# EAGLE design ModPad_1.0 (EAGLE 9.7.0)
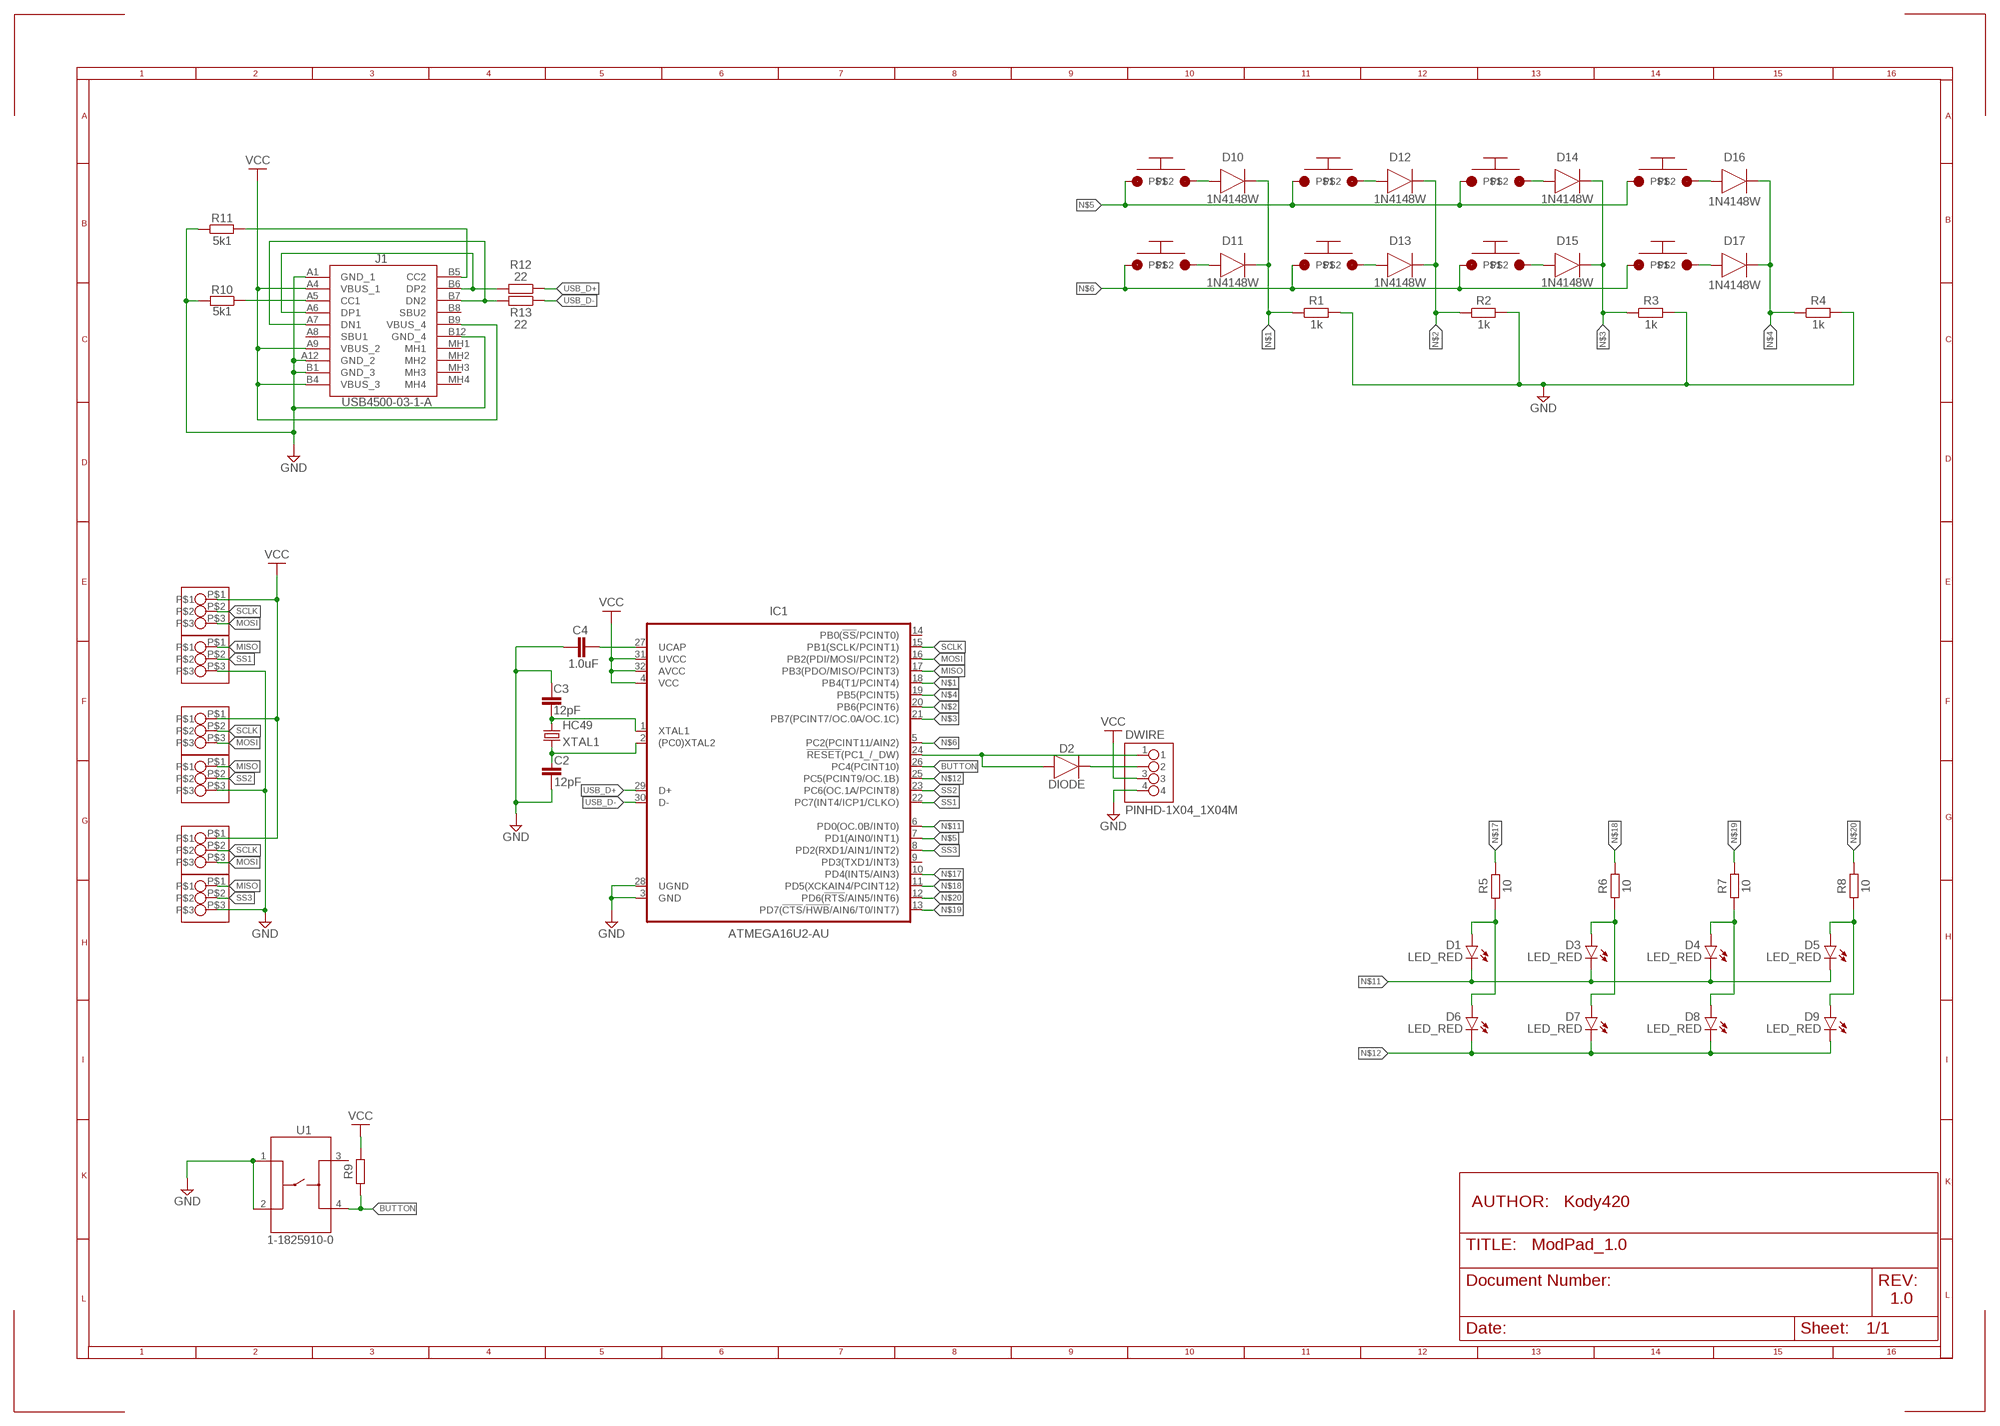
[diagram p0: schematic, sheet 1]

## Parts
C2  12pF  12PF-0603-50V-5%  [0603]
C3  12pF  12PF-0603-50V-5%  [0603]
C4  1.0uF  1.0UF-0603-16V-10%  [0603]
D1  LED_RED  CHIP-FLAT-R_0603-0.80MM  [LEDC1608X80N_FLAT-R]
D2  DIODE  DIODE_DO-219-AC(SOD323F)  [SODFL2513X70]
D3  LED_RED  CHIP-FLAT-R_0603-0.80MM  [LEDC1608X80N_FLAT-R]
D4  LED_RED  CHIP-FLAT-R_0603-0.80MM  [LEDC1608X80N_FLAT-R]
D5  LED_RED  CHIP-FLAT-R_0603-0.80MM  [LEDC1608X80N_FLAT-R]
D6  LED_RED  CHIP-FLAT-R_0603-0.80MM  [LEDC1608X80N_FLAT-R]
D7  LED_RED  CHIP-FLAT-R_0603-0.80MM  [LEDC1608X80N_FLAT-R]
D8  LED_RED  CHIP-FLAT-R_0603-0.80MM  [LEDC1608X80N_FLAT-R]
D9  LED_RED  CHIP-FLAT-R_0603-0.80MM  [LEDC1608X80N_FLAT-R]
D10  1N4148W  DIODE_1N4148W-7-F_SOD123G  [SOD3715X135]
D11  1N4148W  DIODE_1N4148W-7-F_SOD123G  [SOD3715X135]
D12  1N4148W  DIODE_1N4148W-7-F_SOD123G  [SOD3715X135]
D13  1N4148W  DIODE_1N4148W-7-F_SOD123G  [SOD3715X135]
D14  1N4148W  DIODE_1N4148W-7-F_SOD123G  [SOD3715X135]
D15  1N4148W  DIODE_1N4148W-7-F_SOD123G  [SOD3715X135]
D16  1N4148W  DIODE_1N4148W-7-F_SOD123G  [SOD3715X135]
D17  1N4148W  DIODE_1N4148W-7-F_SOD123G  [SOD3715X135]
DWIRE  PINHD-1X04_1X04M  [1X04]
IC1  ATMEGA16U2-AU  [QFP80P900X900X120-32]
J1  USB4500-03-1-A  [USB4500031A]
R1  1k  R_CHIP-0402(1005-METRIC)  [RESC1005X40]
R2  1k  R_CHIP-0402(1005-METRIC)  [RESC1005X40]
R3  1k  R_CHIP-0402(1005-METRIC)  [RESC1005X40]
R4  1k  R_CHIP-0402(1005-METRIC)  [RESC1005X40]
R5  10  R_CHIP-0402(1005-METRIC)  [RESC1005X40]
R6  10  R_CHIP-0402(1005-METRIC)  [RESC1005X40]
R7  10  R_CHIP-0402(1005-METRIC)  [RESC1005X40]
R8  10  R_CHIP-0402(1005-METRIC)  [RESC1005X40]
R9  R_CHIP-0402(1005-METRIC)  [RESC1005X40]
R10  5k1  R_CHIP-0402(1005-METRIC)  [RESC1005X40]
R11  5k1  R_CHIP-0402(1005-METRIC)  [RESC1005X40]
R12  22  R_CHIP-0402(1005-METRIC)  [RESC1005X40]
R13  22  R_CHIP-0402(1005-METRIC)  [RESC1005X40]
U1  1-1825910-0  [SWITCH_1-1825910-0]
U$1  SMD-POGO-3XSMD-POGO-FEMALE-3X  [POGO-FEMALE-3X]
U$2  AKKO-SWITCH  [AKKO-SWITCH]
U$3  AKKO-SWITCH  [AKKO-SWITCH]
U$4  AKKO-SWITCH  [AKKO-SWITCH]
U$5  AKKO-SWITCH  [AKKO-SWITCH]
U$6  AKKO-SWITCH  [AKKO-SWITCH]
U$7  AKKO-SWITCH  [AKKO-SWITCH]
U$8  AKKO-SWITCH  [AKKO-SWITCH]
U$9  AKKO-SWITCH  [AKKO-SWITCH]
U$10  SMD-POGO-3XSMD-POGO-FEMALE-3X  [POGO-FEMALE-3X]
U$11  SMD-POGO-3XSMD-POGO-FEMALE-3X  [POGO-FEMALE-3X]
U$12  SMD-POGO-3XSMD-POGO-FEMALE-3X  [POGO-FEMALE-3X]
U$13  SMD-POGO-3XSMD-POGO-FEMALE-3X  [POGO-FEMALE-3X]
U$14  SMD-POGO-3XSMD-POGO-FEMALE-3X  [POGO-FEMALE-3X]
XTAL1  HC49  CRYSTAL_HC49-11.5L  [XTALRR488W45L1150T500H350B]

## Nets
BUTTON: IC1.26(PC4(PCINT10)) R9.1 U1.4
DN: J1.A7(DN1) J1.B7(DN2) R13.2
DP: J1.A6(DP1) J1.B6(DP2) R12.2
GND: C2.2 C3.2 C4.1 DWIRE.4 IC1.3(GND) IC1.28(UGND) J1.A1(GND_1) J1.A12(GND_2) J1.B1(GND_3) J1.B12(GND_4) R1.2 R2.2 R3.2 R4.2 R10.2 R11.1 U1.1 U1.2 U$10.P$3 U$13.P$3 U$14.P$3
MISO: IC1.17(PB3(PDO/MISO/PCINT3)) U$10.P$1 U$13.P$1 U$14.P$1
MOSI: IC1.16(PB2(PDI/MOSI/PCINT2)) U$1.P$3 U$11.P$3 U$12.P$3
N$1: D10.1(C) D11.1(C) IC1.18(PB4(T1/PCINT4)) R1.1
N$2: D12.1(C) D13.1(C) IC1.20(PB6(PCINT6)) R2.1
N$3: D14.1(C) D15.1(C) IC1.21(PB7(PCINT7/OC.0A/OC.1C)) R3.1
N$4: D16.1(C) D17.1(C) IC1.19(PB5(PCINT5)) R4.1
N$5: IC1.7(PD1(AIN0/INT1)) U$2.P$1 U$3.P$1 U$4.P$1 U$5.P$1
N$6: IC1.5(PC2(PCINT11/AIN2)) U$6.P$1 U$7.P$1 U$8.P$1 U$9.P$1
N$7: C4.2 IC1.27(UCAP)
N$8: D2.1(C) DWIRE.2
N$9: C3.1 IC1.1(XTAL1) XTAL1.1
N$10: C2.1 IC1.2((PC0)XTAL2) XTAL1.2
N$11: D1.C D3.C D4.C D5.C IC1.6(PD0(OC.0B/INT0))
N$12: D6.C D7.C D8.C D9.C IC1.25(PC5(PCINT9/OC.1B))
N$13: D1.A D6.A R5.2
N$14: D3.A D7.A R6.1
N$15: D4.A D8.A R7.1
N$16: D5.A D9.A R8.1
N$17: IC1.10(PD4(INT5/AIN3)) R5.1
N$18: IC1.11(PD5(XCKAIN4/PCINT12)) R6.2
N$19: IC1.13(PD7(!CTS!/!HWB!/AIN6/T0/INT7)) R7.2
N$20: IC1.12(PD6(!RTS!/AIN5/INT6)) R8.2
N$21: D15.2(A) U$8.P$2
N$22: D14.2(A) U$4.P$2
N$23: D12.2(A) U$3.P$2
N$24: D13.2(A) U$7.P$2
N$25: D10.2(A) U$2.P$2
N$26: D11.2(A) U$6.P$2
N$27: D16.2(A) U$5.P$2
N$28: D17.2(A) U$9.P$2
N$29: J1.B5(CC2) R11.2
N$30: J1.A5(CC1) R10.1
RXD: D2.2(A) DWIRE.1 IC1.24(!RESET!(PC1_/_DW))
SCLK: IC1.15(PB1(SCLK/PCINT1)) U$1.P$2 U$11.P$2 U$12.P$2
SS1: IC1.22(PC7(INT4/ICP1/CLKO)) U$13.P$2
SS2: IC1.23(PC6(OC.1A/PCINT8)) U$10.P$2
SS3: IC1.8(PD2(RXD1/AIN1/INT2)) U$14.P$2
USB_D+: IC1.29(D+) R12.1
USB_D-: IC1.30(D-) R13.1
VCC: DWIRE.3 IC1.4(VCC) IC1.31(UVCC) IC1.32(AVCC) J1.A4(VBUS_1) J1.A9(VBUS_2) J1.B4(VBUS_3) J1.B9(VBUS_4) R9.2 U$1.P$1 U$11.P$1 U$12.P$1
Unconnected: IC1.9(PD3(TXD1/INT3)) IC1.14(PB0(!SS!/PCINT0)) J1.A8(SBU1) J1.B8(SBU2) J1.MH1 J1.MH2 J1.MH3 J1.MH4 U1.3

## Notes on the sheet
- AUTHOR: | Kody420
- 1.0

## Library data of the parts
C2 C3 = SparkFun-Capacitors:12PF: 12pF ceramic capacitors A capacitor is a passive two-terminal electrical component used to store electrical energy temporarily in an electric field.; PROD_ID: CAP-09137
C4 = SparkFun-Capacitors:1.0UF: 1µF ceramic capacitors A capacitor is a passive two-terminal electrical component used to store electrical energy temporarily in an electric field.; PROD_ID: CAP-00868
D1 D3-D9 = LED:CHIP-FLAT-R; CATEGORY: LED; COLOR: RED; DESCRIPTION: CHIP LED FLAT; SUB-CATEGORY: CHIP; TYPE: FLAT_TOP
D2 = Diode:DIODE: Diode Rectifier - Generic; CATEGORY: Diode; SUB-CATEGORY: Rectifier
D10-D17 = Diode:DIODE_: Diode Rectifier - Popular parts; CATEGORY: Diode; DESCRIPTION: DIODE GEN PURP 100V 300MA SOD123; MANUFACTURER: Diodes Incorporated; SUB-CATEGORY: Rectifier
DWIRE = Tinkercad:PINHD-1X04
IC1 = IC_Embedded:ATMEGA*U2: 8-bit Microcontroller Datasheet <https://ww1.microchip.com/downloads/en/DeviceDoc/doc7799.pdf> Note:For this part User needs to add thermal via in thermal pad in QFN package while designing a board.; CATEGORY: IC_Embedded; CORE: AVR; DESCRIPTION: IC MCU 8BIT 16KB FLASH 32TQFP; MANUFACTURER: Microchip Technology; MPN: ATMEGA16U2-AU; OPERATING_TEMP: -40°C to +85°C; PART_STATUS: Active; ROHS_COMPLIANT: COMPLIANT; SUB-CATEGORY: Microcontroller; TYPE: 8 bit Microcontroller
J1 = USB-C:USB4500-03-1-A: USB Connectors USB C Rec 16P 3u" Mid Mnt 0.8mm O-set SMT L = 6.5mm S-Spring-1 Source: Datasheet; DESCRIPTION: USB Connectors USB C Rec 16P 3u" Mid Mnt 0.8mm O-set SMT L = 6.5mm S-Spring-1; HEIGHT: 3.36mm; MANUFACTURER_NAME: GCT (GLOBAL CONNECTOR TECHNOLOGY); MANUFACTURER_PART_NUMBER: USB4500-03-1-A
R1-R13 = Resistor:R: Resistor Fixed - Generic; CATEGORY: Resistor; SUB-CATEGORY: Fixed
U1 = Switches:1-1825910-0; BUILT_BY: EMA_UL_Team; CATEGORY: Tactile Switches; COPYRIGHT: Copyright (C) 2016 Accelerated Designs. All rights reserved; DESCRIPTION: FSM6JH=6MM TACT SWITCH, HIGH TEMP; MANUFACTURER_PART_NUMBER: 1-1825910-0; PART_STATUS: active; SERIES: Unknown; VENDOR: TE Connectivity
U$1 U$10-U$14 = SMD-POGO-3X:SMD-POGO-3X
U$2-U$9 = Switch:AKKO-SWITCH
XTAL1 = Frequency-Source:CRYSTAL: Crystal 2Pin - Generic; CATEGORY: Frequency-Source; SUB-CATEGORY: Crystal-2Pin

## Board
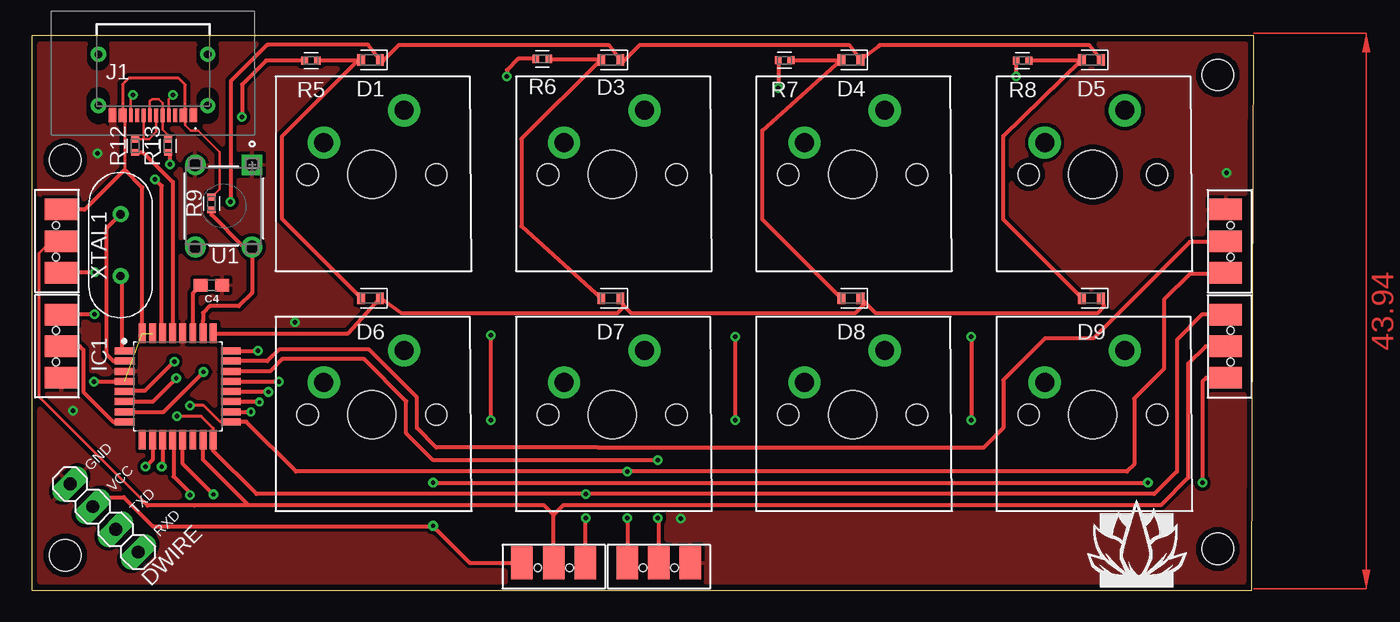
[diagram p1: board, top side]
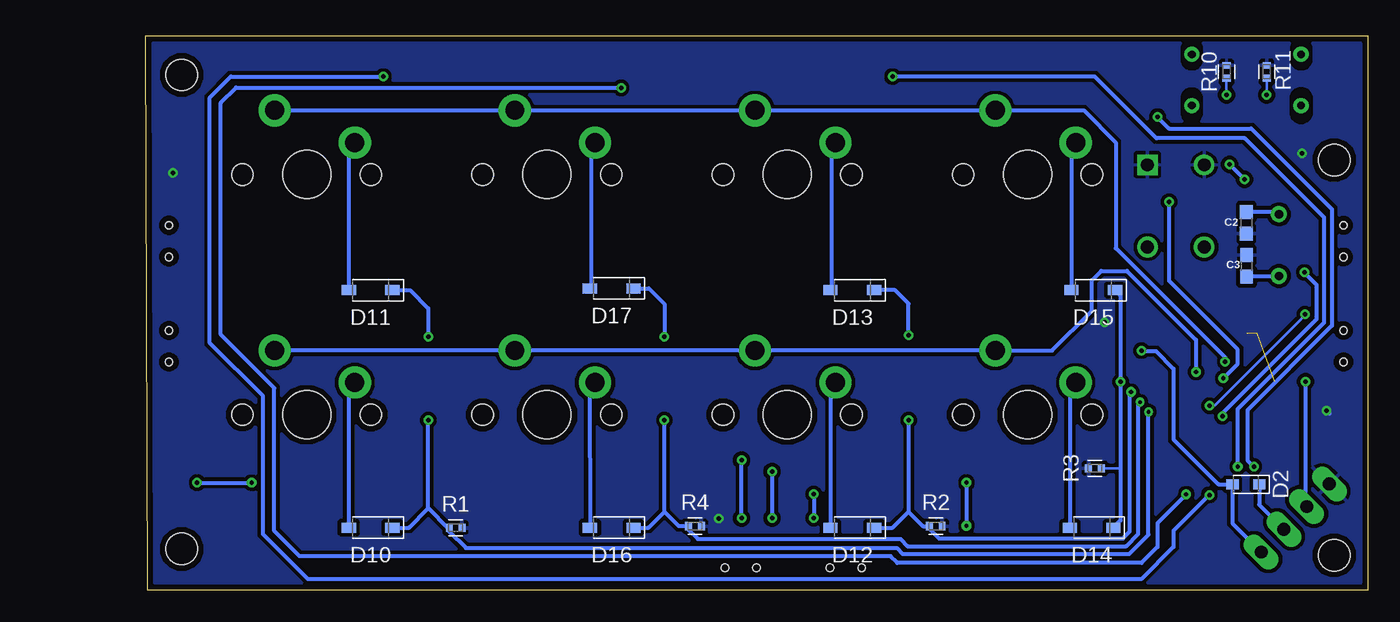
[diagram p2: board, bottom side, seen from below]

Size 96.63 x 43.87 mm. Coordinates in mm from the lower left corner, seen from the top.
Outline: 0,43.87 0,0 96.5,0 96.63,43.87 0,43.87
Copper layers (1*16): Top / Bottom
Stack-up Default Layer Stack: Top User Defined 0.035mm / Dielectric-1 User Defined 1.5mm / Bottom User Defined 0.035mm
Design rules: minimum copper width 8mil, minimum drill size 0.3mm, copper clearance wire_polygon to wire_polygon 12mil, copper clearance wire_polygon to pad_smd 12mil, copper clearance wire_polygon to via 12mil, copper clearance pad_smd to via 12mil, copper clearance via to via 12mil, copper clearance smd to pad (same net) 12mil, copper clearance smd to via (same net) 12mil, copper clearance smd to smd (same net) 12mil, copper clearance pad_smd to pad_smd 6mil, dimension clearance 18mil, via restrict clearance 0mil, restrict clearance 0mil, drill distance 6mil, keepout clearance 0mil
Holes 2.5 mm at 2.66,34.04 93.8,3.27 93.8,40.77 2.66,2.77

### Footprints (pad centres in the part's own frame; a part is rotated, then mirrored left to right if it is on the bottom)
0603 = smd 1.1 x 1: 1 -0.85,0; 2 0.85,0
LEDC1608X80N_FLAT-R = smd 0.612 x 0.912: A 0.75,0; C -0.75,0
SODFL2513X70 = smd 0.985 x 0.774: 1 -1.065,0; 2 1.065,0
SOD3715X135 = smd 1.127 x 0.784: 1 -1.722,0; 2 1.722,0
1X04 = drill 1.016 long: 1 -3.81,0; 2 -1.27,0; 3 1.27,0; 4 3.81,0
QFP80P900X900X120-32 = smd 1.55 x 0.55: 1 -4.2,2.8; 2 -4.2,2; 3 -4.2,1.2; 4 -4.2,0.4; 5 -4.2,-0.4; 6 -4.2,-1.2; 7 -4.2,-2; 8 -4.2,-2.8; 17 4.2,-2.8; 18 4.2,-2; 19 4.2,-1.2; 20 4.2,-0.4; 21 4.2,0.4; 22 4.2,1.2; 23 4.2,2; 24 4.2,2.8 | smd 0.55 x 1.55: 9 -2.8,-4.2; 10 -2,-4.2; 11 -1.2,-4.2; 12 -0.4,-4.2; 13 0.4,-4.2; 14 1.2,-4.2; 15 2,-4.2; 16 2.8,-4.2; 25 2.8,4.2; 26 2,4.2; 27 1.2,4.2; 28 0.4,4.2; 29 -0.4,4.2; 30 -1.2,4.2; 31 -2,4.2; 32 -2.8,4.2
USB4500031A = smd 0.3 x 1.1: A1 -3.35,3.625; A4 -2.55,3.625; A5 -1.25,3.625; A6 -0.25,3.625; A7 0.25,3.625; A8 1.25,3.625; A9 2.55,3.625; A12 3.35,3.625; B1 3.05,3.625; B4 2.25,3.625; B5 1.75,3.625; B6 0.75,3.625; B7 -0.75,3.625; B8 -1.75,3.625; B9 -2.25,3.625; B12 -3.05,3.625 | drill 0.6 pad 1.1 slot 1.7 rotated 90: MH1 -4.32,2.85; MH2 4.32,2.85 | drill 0.6 pad 1.1 slot 1.4 rotated 90: MH3 -4.32,-1.21; MH4 4.32,-1.21
RESC1005X40 = smd 0.535 x 0.644: 1 -0.507,0; 2 0.507,0
SWITCH_1-1825910-0 = drill 1.016 pad 1.524 square: 1 -6.502,4.496 | drill 1.016 pad 1.524: 2 -6.502,0; 3 0,0; 4 0,4.496
POGO-FEMALE-3X = smd 1.7 x 2.6: P$1 2.5,-1.3; P$2 0,-1.3; P$3 -2.5,-1.3 | hole 0.6: -1.25,-0.9; 1.25,-0.9
AKKO-SWITCH = drill 1.499 pad 2.54: P$1 10.16,12.7; P$2 3.81,10.16 | hole 3.81: 7.62,7.62 | hole 1.702: 2.54,7.62; 12.7,7.62
XTALRR488W45L1150T500H350B = drill 0.657 pad 1.257: 1 -2.44,0; 2 2.44,0

### Placement (x,y rotation side)
C2  9.62,29.07 270 bottom
C3  9.58,25.66 90 bottom
C4  14.22,24.13 180 top
D1  26.8,41.96 180 top
D2  9.65,8.38 180 bottom
D3  45.8,41.96 180 top
D4  64.8,41.96 180 top
D5  83.8,41.96 180 top
D6  26.8,23.11 180 top
D7  45.8,23.11 180 top
D8  64.8,23.11 180 top
D9  83.8,23.11 180 top
D10  78.87,4.95 180 bottom
D11  78.87,23.75 180 bottom
D12  40.77,4.95 180 bottom
D13  40.77,23.75 180 bottom
D14  21.84,4.95 180 bottom
D15  21.72,23.75 180 bottom
D16  59.8,4.95 180 bottom
D17  59.8,23.88 180 bottom
DWIRE  5.74,5.72 135 top
IC1  11.56,16.13 0 top
J1  9.6,41.19 180 top
R1  72.14,4.95 0 bottom
R2  34.16,5.08 0 bottom
R3  21.59,9.65 180 bottom
R4  53.21,5.08 0 bottom
R5  22.1,41.91 0 top
R6  40.39,42.04 180 top
R7  59.55,41.92 180 top
R8  78.36,41.91 180 top
R9  14.22,30.61 90 top
R10  11.18,41.02 90 bottom
R11  8,41.02 270 bottom
R12  8.19,35.16 90 top
R13  10.79,35.16 90 top
U1  12.94,27.16 270 top
U$1  95.71,19.3 270 top
U$2  76.3,6.27 0 top
U$3  38.3,6.27 0 top
U$4  19.3,6.27 0 top
U$5  57.3,6.27 0 top
U$6  76.3,25.27 0 top
U$7  38.3,25.27 0 top
U$8  19.3,25.27 0 top
U$9  57.3,25.27 0 top
U$10  95.71,27.63 270 top
U$11  1.03,27.63 90 top
U$12  41.27,0.89 180 top
U$13  49.6,0.89 180 top
U$14  1.03,19.3 90 top
XTAL1  7.03,27.31 90 top

### Tracks (layer width: path | path; a pad name or v marks a point on that pad's centre or on a via)
BUTTON
  Top 0.305: R9.1 14.22,29.72 16.79,27.16 U1.4 17.43,23.53 16.38,22.48 14.1,22.48 13.56,21.94 13.56,21.35 13.56,21.21 IC1.26
DN
  Top 0.203: J1.A7 9.35,38.69 9.52,38.86 10.03,38.86 10.35,38.54 J1.B7 10.35,36.45 10.79,36.01 R13.2
DP
  Top 0.203: R12.2 8.22,35.7 8.85,35.7 | J1.A6 9.85,36.27 9.28,35.7 8.85,35.7 | J1.B6 8.85,35.7
  Top 0.254: J1.B6
GND  (via drill 0.35)
  Bottom 0.305: 3.04,13.99 v3.28,14.22
  other vias: 94.49,33.02 51.33,5.66 20.83,21.21 5.19,34.56
  pour Bottom: 0.13,44.07 0.13,-0.38 96.65,-0.38 96.65,44.07
  pour Top: -2.41,47.88 -2.41,-2.92 99.19,-2.92 99.19,47.88
MISO  (via drill 0.35)
  Top 0.254: v12.52,14.6 12.55,14.63 13.59,14.63 14.9,13.33 IC1.17
  Top 0.305: U$10.P$1 94.3,25.02 91.57,25.02 89.53,22.99 89.53,17.53 87.18,15.17 87.18,9.97 86.61,9.4 v47.12,9.4 20.91,9.4 16.98,13.33 IC1.17 | 2.44,21.7 U$14.P$1 2.37,21.84 4.96,21.84 v4.97,21.83 | v47.12,5.71 47.12,2.21 U$13.P$1
  Bottom 0.254: v12.52,14.6 12.15,14.6 4.96,21.8
  Bottom 0.305: v47.12,9.4 v47.12,5.71 | v4.97,21.83 4.97,21.8 4.96,21.8
MOSI  (via drill 0.35)
  Top 0.254: IC1.16 14.36,12.83 13.41,13.77 v11.5,13.77
  Top 0.305: U$1.P$3 92.54,21.8 90.56,19.82 90.56,9.41 88.77,7.62 v43.81,7.62 17.78,7.62 14.36,11.04 IC1.16 | v43.81,5.71 43.81,2.23 U$12.P$3 | v5.03,25.15 2.35,25.15 U$11.P$3
  Bottom 0.305: v43.81,7.62 v43.81,5.71 | v5.03,25.15 4.06,24.18 4.06,21.43 11.5,14 v11.5,13.77
N$1  (via drill 0.3, 0.35)
  Top 0.305: v74.3,20.07 v74.3,13.46 | IC1.18 v17.33,14.13 v17.34,14.12
  Bottom 0.305: D10.1 75.82,4.95 74.3,6.48 | 74.3,6.48 | 74.3,6.48 72.77,4.95 R1.1 72.66,4.94 72.66,4.68 71.33,3.34 37.25,3.34 36.79,2.88 18.86,2.88 17.35,4.4 17.35,14.11 v17.34,14.12 | D11.1 75.75,23.75 74.3,22.3 v74.3,20.07 | 74.3,6.48 v74.3,13.46
N$2  (via drill 0.35)
  Top 0.305: v36.32,13.46 v36.32,20.19 | IC1.20 15.77,15.72 18.6,15.72 18.63,15.69 v18.72,15.69
  Bottom 0.305: v36.32,20.19 36.32,22.68 37.39,23.75 D13.1 | v36.32,13.46 36.32,6.22 | 36.32,6.22 35.18,5.08 R2.1 34.67,4.86 33.91,4.1 19.37,4.1 18.82,4.65 18.82,15.59 v18.72,15.69 | D12.1 37.59,4.95 36.32,6.22
N$3  (via drill 0.35)
  Top 0.305: IC1.21 19.52,16.53 v19.56,16.49
  Bottom 0.203: R3.1 19.56,9.65
  Bottom 0.305: D14.1 19.56,5.52 19.56,9.65 v19.56,16.49 19.56,23.31 D15.1
N$4  (via drill 0.3, 0.35)
  Top 0.305: v55.63,20.07 v55.63,13.46 | IC1.19 17.97,14.93 v18.01,14.89
  Bottom 0.305: D16.1 56.9,4.95 55.63,6.22 | 55.63,6.22 54.48,5.08 R4.1 53.72,4.79 52.99,4.05 36.96,4.05 36.4,3.49 19.12,3.49 18.16,4.45 18.16,14.74 v18.01,14.89 | D17.1 56.85,23.88 55.63,22.65 v55.63,20.07 | 55.63,6.22 v55.63,13.46
N$5  (via drill 0.35)
  Top 0.305: IC1.7 10.45,14.13 v13.59,17.27
  Bottom 0.305: U$2.P$1 U$5.P$1 U$3.P$1 U$4.P$1 24.97,18.97 21.84,22.1 21.84,24.51 21.08,25.27 19.05,25.27 13.59,19.81 v13.59,17.27
N$6  (via drill 0.35)
  Top 0.305: IC1.5 7.42,15.8 8.98,15.8 v11.28,18.1
  Bottom 0.305: U$6.P$1 U$9.P$1 U$7.P$1 U$8.P$1 22.47,37.97 19.94,35.43 19.94,27.06 11.28,18.4 v11.28,18.1
N$7
  Top 0.305: 12.82,20.4 IC1.27 12.76,23.51 C4.2
N$8
  Bottom 0.305: D2.1 8.59,6.77 DWIRE.2
N$9
  Top 0.305: XTAL1.1 7.11,24.79 7.11,18.86 7.29,18.86 IC1.1
  Bottom 0.305: XTAL1.1 9.53,24.87 C3.1
N$10
  Top 0.305: IC1.2 6.46,18.13 5.94,18.65 5.94,28.66 XTAL1.2
  Bottom 0.305: XTAL1.2 7.21,29.92 C2.1
N$11  (via drill 0.35)
  Top 0.305: 27.73,41.82 D1.C | D1.C 27.8,41.89 29.05,43.14 45.61,43.14 D3.C 46.8,41.84 48.1,43.14 64.61,43.14 D4.C 66.97,43.04 67.08,43.14 83.61,43.14 D5.C | D1.C 26.61,43.14 18.63,43.14 15.75,40.26 15.75,30.74 v15.72,30.74 | IC1.6 9.59,14.93 v11.43,16.76
  Bottom 0.305: v11.43,16.76 10.29,17.91 10.29,19.05 15.72,24.48 v15.72,30.74
N$12
  Top 0.305: 27.6,23.37 D6.C | D6.C 29.26,21.91 46.28,21.91 46.8,22.42 D7.C 46.8,22.53 47.42,21.91 65.1,21.91 65.8,22.61 D8.C 65.8,22.86 66.75,21.91 84.26,21.91 84.8,22.44 D9.C | IC1.25 25.01,20.33 D6.C
N$13
  Top 0.305: D6.A 19.81,29.35 19.81,35.94 25.7,41.82 D1.A 25.75,41.91 R5.2
N$14
  Top 0.305: D7.A 38.73,28.8 38.73,35.72 D3.A | D3.A 40.9,41.96 R6.1 | 44.8,41.76 D3.A
N$15
  Top 0.305: R7.1 60.1,41.88 63.78,41.88 D4.A 57.78,36.37 57.78,29.34 63.75,23.37 D8.A
N$16
  Top 0.305: D9.A 82.8,23.37 76.83,29.34 76.83,35.95 D5.A 82.75,41.91 R8.1
N$17  (via drill 0.35)
  Top 0.305: R5.1 18.54,41.91 16.64,40 v16.64,37.46 | IC1.10 9.56,10.32 v9.02,9.78
  Bottom 0.305: v9.02,9.78 9.52,10.29 9.52,14.25 2.84,20.93 2.84,30.15 9.22,36.53 15.74,36.53 16.64,37.43 v16.64,37.46
N$18  (via drill 0.35)
  Top 0.305: R6.2 38.48,42.04 37.59,41.15 v37.59,40.64 | IC1.11 10.36,9.85 v10.29,9.78
  Bottom 0.305: v37.59,40.64 21.59,40.64 16.72,35.77 9.73,35.77 3.45,29.49 3.45,21.18 10.29,14.35 v10.29,9.78
N$19  (via drill 0.35)
  Top 0.305: R7.2 59.05,41.91 v59.05,39.75 | IC1.13 11.96,10 v14.36,7.59
  Bottom 0.305: v59.05,39.75 59.08,39.78 89.51,39.78 90.71,38.57 90.71,20.23 86.49,16 86.49,4.7 84.49,2.7 37.74,2.7 37.2,2.16 17.91,2.16 16.64,3.43 16.64,5.32 v14.36,7.59
N$20  (via drill 0.35)
  Top 0.305: IC1.12 11.22,11.86 11.22,9 12.53,7.69 v12.53,7.55 | R8.2 v77.85,40.64
  Bottom 0.305: v77.85,40.64 89.92,40.64 91.57,38.99 91.57,19.56 87.38,15.37 87.38,4.45 83.82,0.89 51.23,0.89 51.22,0.88 17.92,0.88 15.37,3.43 15.37,4.71 v12.53,7.55
N$21
  Bottom 0.305: U$8.P$2 23.44,34.73 D15.2
N$22
  Bottom 0.305: U$4.P$2 23.57,15.97 D14.2
N$23
  Bottom 0.305: U$3.P$2 42.49,16.05 D12.2
N$24
  Bottom 0.305: U$7.P$2 42.18,35.18 42.4,34.96 42.4,23.84 D13.2
N$25
  Bottom 0.305: U$2.P$2 80.59,15.95 D10.2
N$26
  Bottom 0.305: U$6.P$2 80.59,34.95 D11.2
N$27
  Bottom 0.305: D16.2 61.54,16 U$5.P$2
N$28
  Bottom 0.305: D17.2 61.4,23.91 61.4,34.89 U$9.P$2
N$29  (via drill 0.35)
  Top 0.203: J1.B5 7.85,39.04 v8,39.18
  Bottom 0.203: R11.2 v8,39.18
N$30  (via drill 0.35)
  Top 0.203: J1.A5 10.85,38.86 v11.18,39.18
  Bottom 0.203: R10.1 v11.18,39.18
RXD  (via drill 0.35)
  Top 0.305: IC1.24 17.87,18.93 v17.91,18.96
  Bottom 0.305: DWIRE.1 10.72,5.31 D2.2 11.81,8.38 15.37,11.94 15.37,17.53 16.76,18.92 17.87,18.92 v17.91,18.96
SCLK
  Top 0.254: U$11.P$2 2.33,27.3 2.32,27.31 1.24,27.31 0.58,26.66 0.58,15.29 8.89,6.98
  Top 0.305: 17.14,6.73 40.51,6.73 41.27,5.97 | U$1.P$2 92.84,19.3 91.44,17.91 91.44,8.89 89.28,6.73 42.04,6.73 41.27,5.97 | U$11.P$2 2.4,27.56 | U$12.P$2 41.27,5.97 | 17.14,6.73 13.56,10.32 IC1.15 | 17.14,6.73 12.9,6.73 12.88,6.71 9.16,6.71 8.89,6.98
SS1  (via drill 0.35)
  Top 0.305: U$13.P$2 49.6,5.65 v49.53,5.71 | v49.53,10.29 31.75,10.29 29.62,12.42 29.62,14.96 26.29,18.29 19.81,18.29 18.85,17.33 IC1.22
  Bottom 0.305: v49.53,5.71 v49.53,10.29
SS2
  Top 0.305: U$10.P$2 94.34,27.56 91.57,27.56 83.95,19.94 80.14,19.94 76.83,16.64 76.83,12.83 75.28,11.27 44.83,11.27 44.8,11.3 32,11.3 30.48,12.83 30.48,15.24 26.67,19.05 19.56,19.05 18.64,18.13 IC1.23
SS3
  Top 0.305: U$14.P$2 3.81,19.3 4.09,19.02 4.09,15.7 6.46,13.33 IC1.8
USB_D+
  Top 0.305: R12.1 8.8,34.65 11.16,32.3 IC1.29
USB_D-  (via drill 0.35)
  Top 0.305: 10.42,20.42 10.42,20.4 IC1.30 10.29,20.4 10.29,31.98 v9.76,32.51 | R13.1 10.93,34.51 v10.93,33.7
  Bottom 0.305: v10.93,33.7 10.93,33.69 v9.76,32.51
VCC  (via drill 0.35)  (2 unrouted)
  Top 0.203: R9.2 14.86,31.75 14.86,34.67 13.17,36.36 12.59,36.36 12.15,36.79 J1.A4
  Top 0.254: J1.A9 J1.B4 | J1.B9 J1.A4 12.15,39.99 11.64,40.5 7.66,40.5 7.19,40.03 7.19,37.73 J1.B4 | J1.B4 7.35,33.26
  Top 0.305: U$11.P$1 2.36,30.1 4.19,30.1 7.35,33.26 7.37,33.27 8.76,31.88 IC1.32 | U$1.P$1 92.88,16.8 92.58,16.51 v92.58,8.51 | 31.75,5.08 34.64,2.19 U$12.P$1 | v31.75,8.51 v88.26,8.51 v88.27,8.51 | DWIRE.3 | IC1.4 7.34,16.51 v4.92,16.51 | DWIRE.3 5.59,7.37 7.29,7.37 9.58,5.08 31.75,5.08 | v31.75,5.1 31.75,5.08
  Bottom 0.305: v92.58,8.51 v88.27,8.51 | v4.92,16.51 4.97,16.47 4.97,6.75 DWIRE.3 | v31.75,8.51 v31.75,5.1
(copper drawn outside any net)
  shapes: Top area x1

### Text on the board
NamesTop: GND | VCC | TXD | RXD